# EAGLE schematic blink1mk3_005t6_5050_4l_usbc2020 (EAGLE 9.5.2)
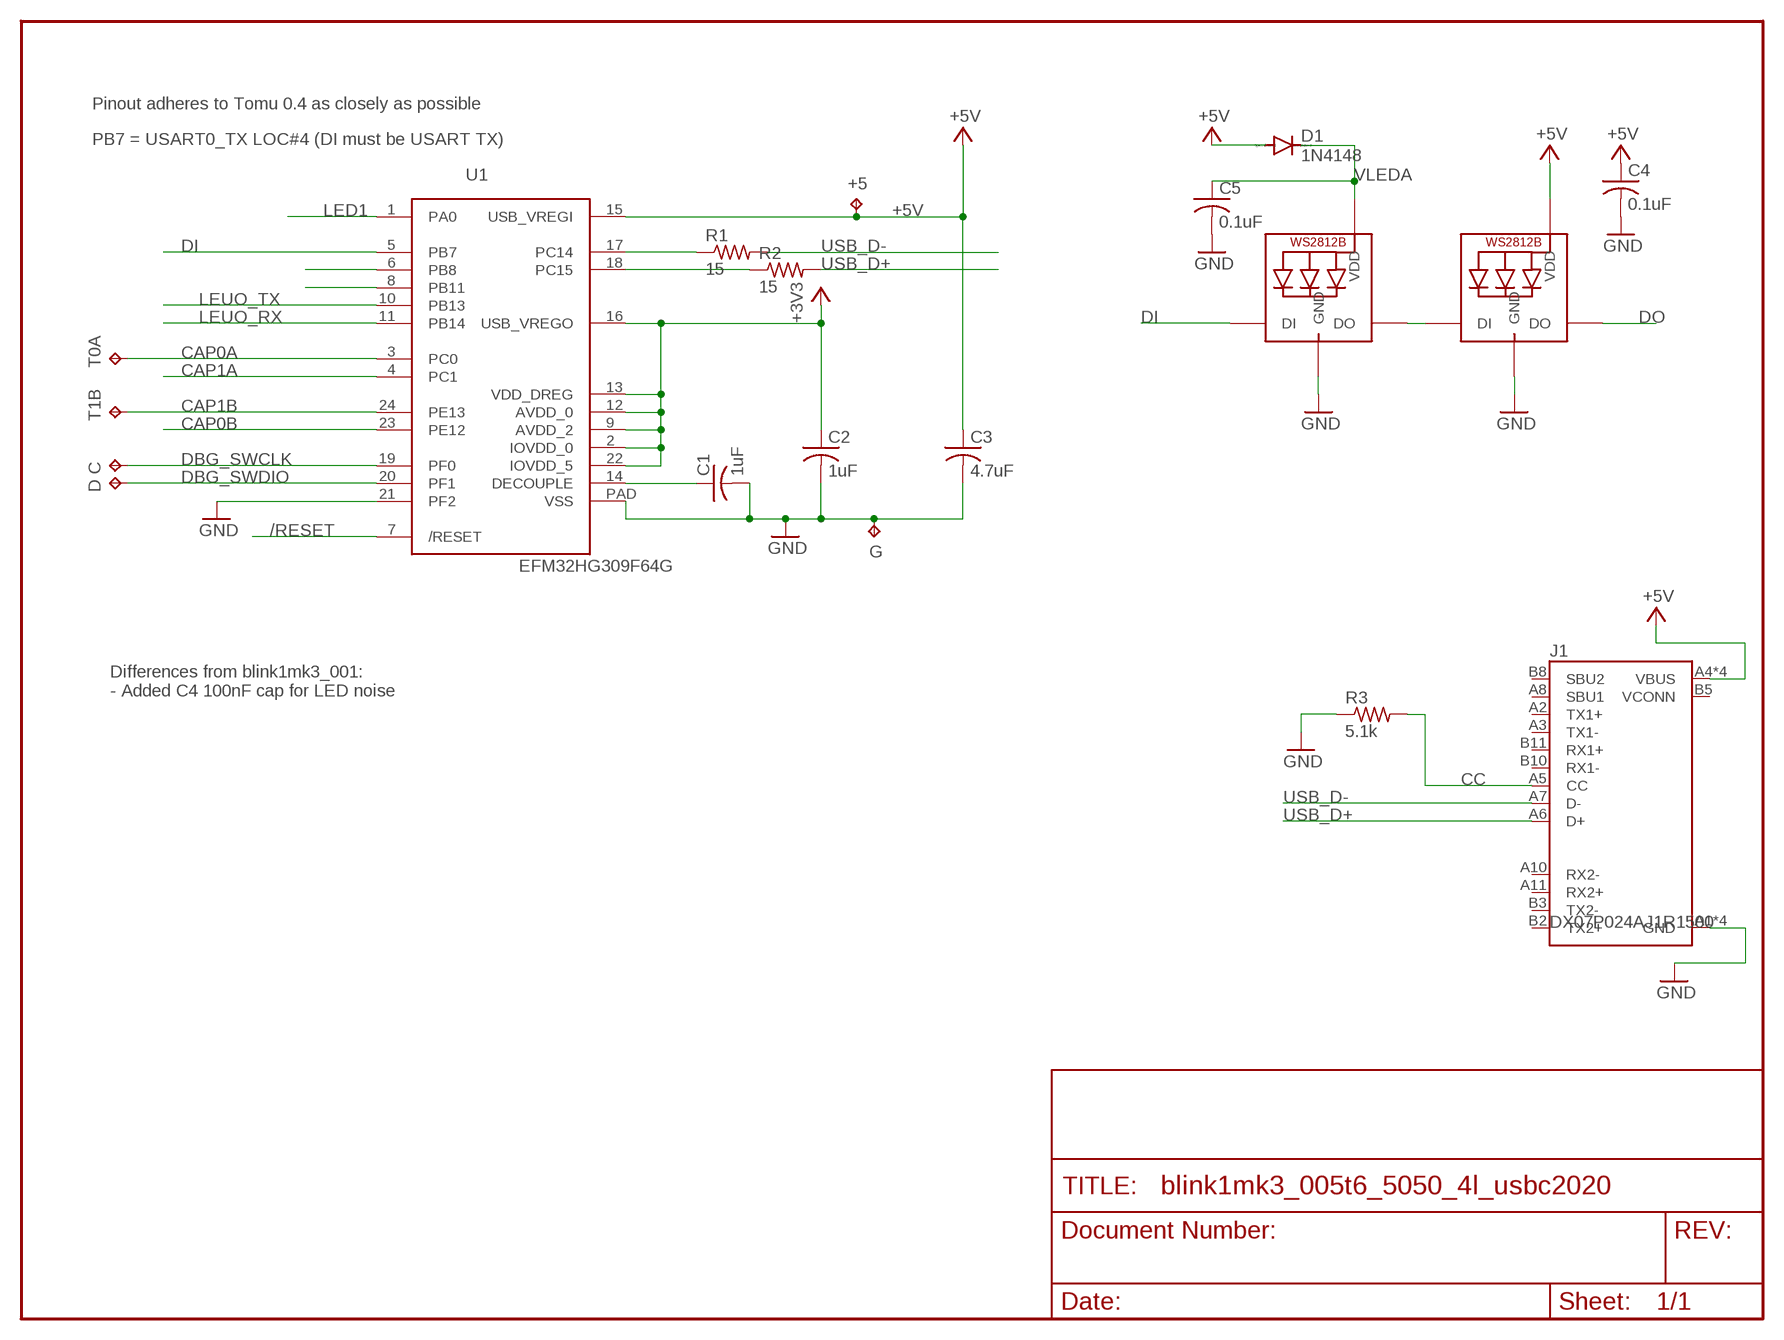
[diagram p0: schematic, sheet 1]

## Parts
+5  TPTP10R  [TP10R]
C  TPTP10R  [TP10R]
C1  1uF  C-USC0402  [C0402]
C2  1uF  C-USC0402  [C0402]
C3  4.7uF  C-USC0402  [C0402]
C4  0.1uF  C-USC0402  [C0402]
C5  0.1uF  C-USC0402  [C0402]
D  TPTP10R  [TP10R]
D1  1N4148  DIODE-SOD523  [SOD523]
G  TPTP10R  [TP10R]
J1  DX07P024AJ1R1500  [JAE_DX07P024AJ1R1500]
LED1  SK6812MINI  WS2812B5050  [WS2812B]
LED2  SK6812MINI  WS2812B5050  [WS2812B]
R1  15  R-US_R0402  [R0402]
R2  15  R-US_R0402  [R0402]
R3  5.1k  R-US_R0402  [R0402]
T0A  TPTP15R  [TP15R]
T1B  TPTP15R  [TP15R]
U1  EFM32HG309F64G  [QFN24PAD]

## Nets
+3V3: C2.1 U1.2(IOVDD_0) U1.9(AVDD_2) U1.12(AVDD_0) U1.13(VDD_DREG) U1.16(USB_VREGO) U1.22(IOVDD_5)
+5V: +5.TP C3.1 C4.1 D1.A J1.A4(VBUS) J1.A9(VBUS) J1.B4(VBUS) J1.B9(VBUS) LED2.1-VDD(VDD) U1.15(USB_VREGI)
/RESET: U1.7(/RESET)
CAP0A: T0A.TP U1.3(PC0)
CAP0B: U1.23(PE12)
CAP1A: U1.4(PC1)
CAP1B: T1B.TP U1.24(PE13)
CC: J1.A5(CC) R3.2
DBG_SWCLK: C.TP U1.19(PF0)
DBG_SWDIO: D.TP U1.20(PF1)
DECOUPLE: C1.1 U1.14(DECOUPLE)
DI: LED1.4-DIN(DI) U1.5(PB7)
DO: LED2.2-DOUT(DO)
GND: C1.2 C2.2 C3.2 C4.2 C5.2 G.TP J1.A1(GND) J1.A12(GND) J1.B1(GND) J1.B12(GND) LED1.3-GND(GND) LED2.3-GND(GND) R3.1 U1.21(PF2) U1.PAD(VSS)
LED1: U1.1(PA0)
LEUO_RX: U1.11(PB14)
LEUO_TX: U1.10(PB13)
N$1: U1.8(PB11)
N$2: LED1.2-DOUT(DO) LED2.4-DIN(DI)
N$3: U1.6(PB8)
RUSB_D+: R2.1 U1.18(PC15)
RUSB_D-: R1.1 U1.17(PC14)
USB_D+: J1.A6(D+) R2.2
USB_D-: J1.A7(D-) R1.2
VLEDA: C5.1 D1.C LED1.1-VDD(VDD)
Unconnected: J1.A2(TX1+) J1.A3(TX1-) J1.A8(SBU1) J1.A10(RX2-) J1.A11(RX2+) J1.B2(TX2+) J1.B3(TX2-) J1.B8(SBU2) J1.B10(RX1-) J1.B11(RX1+)

## Notes on the sheet
- Pinout adheres to Tomu 0.4 as closely as possible
- PB7 = USART0_TX LOC#4 (DI must be USART TX)
- Differences from blink1mk3_001:
  - Added C4 100nF cap for LED noise

## Power pins joined to a net without a drawn wire
VCONN: J1.B5(VCONN)

## Library data of the parts
+5 C D G T0A T1B = testpad:TP: Test pad
C1-C5 = adafruit:C-US: CAPACITOR, American symbol
D1 = diode:DIODE-: DIODE
J1 = DX07P024AJ1R1500:DX07P024AJ1R1500: Cut Tape - Usb Type c Slim Plug; DESCRIPTION: Cut Tape - Usb Type c Slim Plug; DIGI-KEY_PART_NUMBER: 670-2868-1-ND; DIGI-KEY_PURCHASE_URL: https://www.digikey.com/product-detail/en/jae-electronics/DX07P024AJ1R1500/670-2868-1-ND/6003057?utm_source=snapeda&utm_medium=aggregator&utm_campaign=symbol; MF: JAE Electronics; MP: DX07P024AJ1R1500; PACKAGE: None
LED1 LED2 = adafruit:WS2812B
R1 R2 = rcl:R-US_: RESISTOR, American symbol; SPICEPREFIX: R
R3 = adafruit:R-US_: RESISTOR, American symbol
U1 = todstuff:EFM32HG309F64G